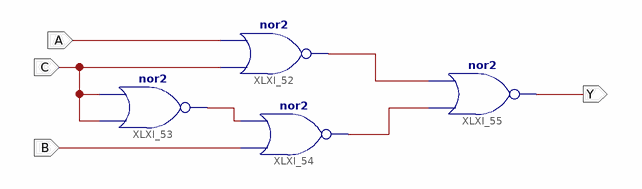
[diagram p0: schematic sheet 1]
// Xilinx ISE schematic SELECTOR.sch (spartan6) as structural Verilog: 4 symbols, 4 ports
module SELECTOR (
  input  A,
  input  C,
  input  B,
  output Y
);

  wire XLXN_80, XLXN_81, XLXN_82;

  nor XLXI_52 (XLXN_82, C, A);
  nor XLXI_53 (XLXN_80, C, C);
  nor XLXI_54 (XLXN_81, B, XLXN_80);
  nor XLXI_55 (Y, XLXN_81, XLXN_82);
endmodule
